# Altium schematic sheet 20_KEY_M_X2.SchDoc: C200
size 439 x 311 mm; Page Create Date: March  8, 1995; Page Number: 20; Page Size: Custom; Comment: radxa_1010; Page Count: 21; RevCode: V1.11; Doc: 20_KEY_M_X2; DsnPath: D:\WMS\C200\CC122\对外\C200 V1.11.DSN; SchematicName: c200; PageName: 20_KEY_M_X2; PageSize: Custom; TopSchematic: True
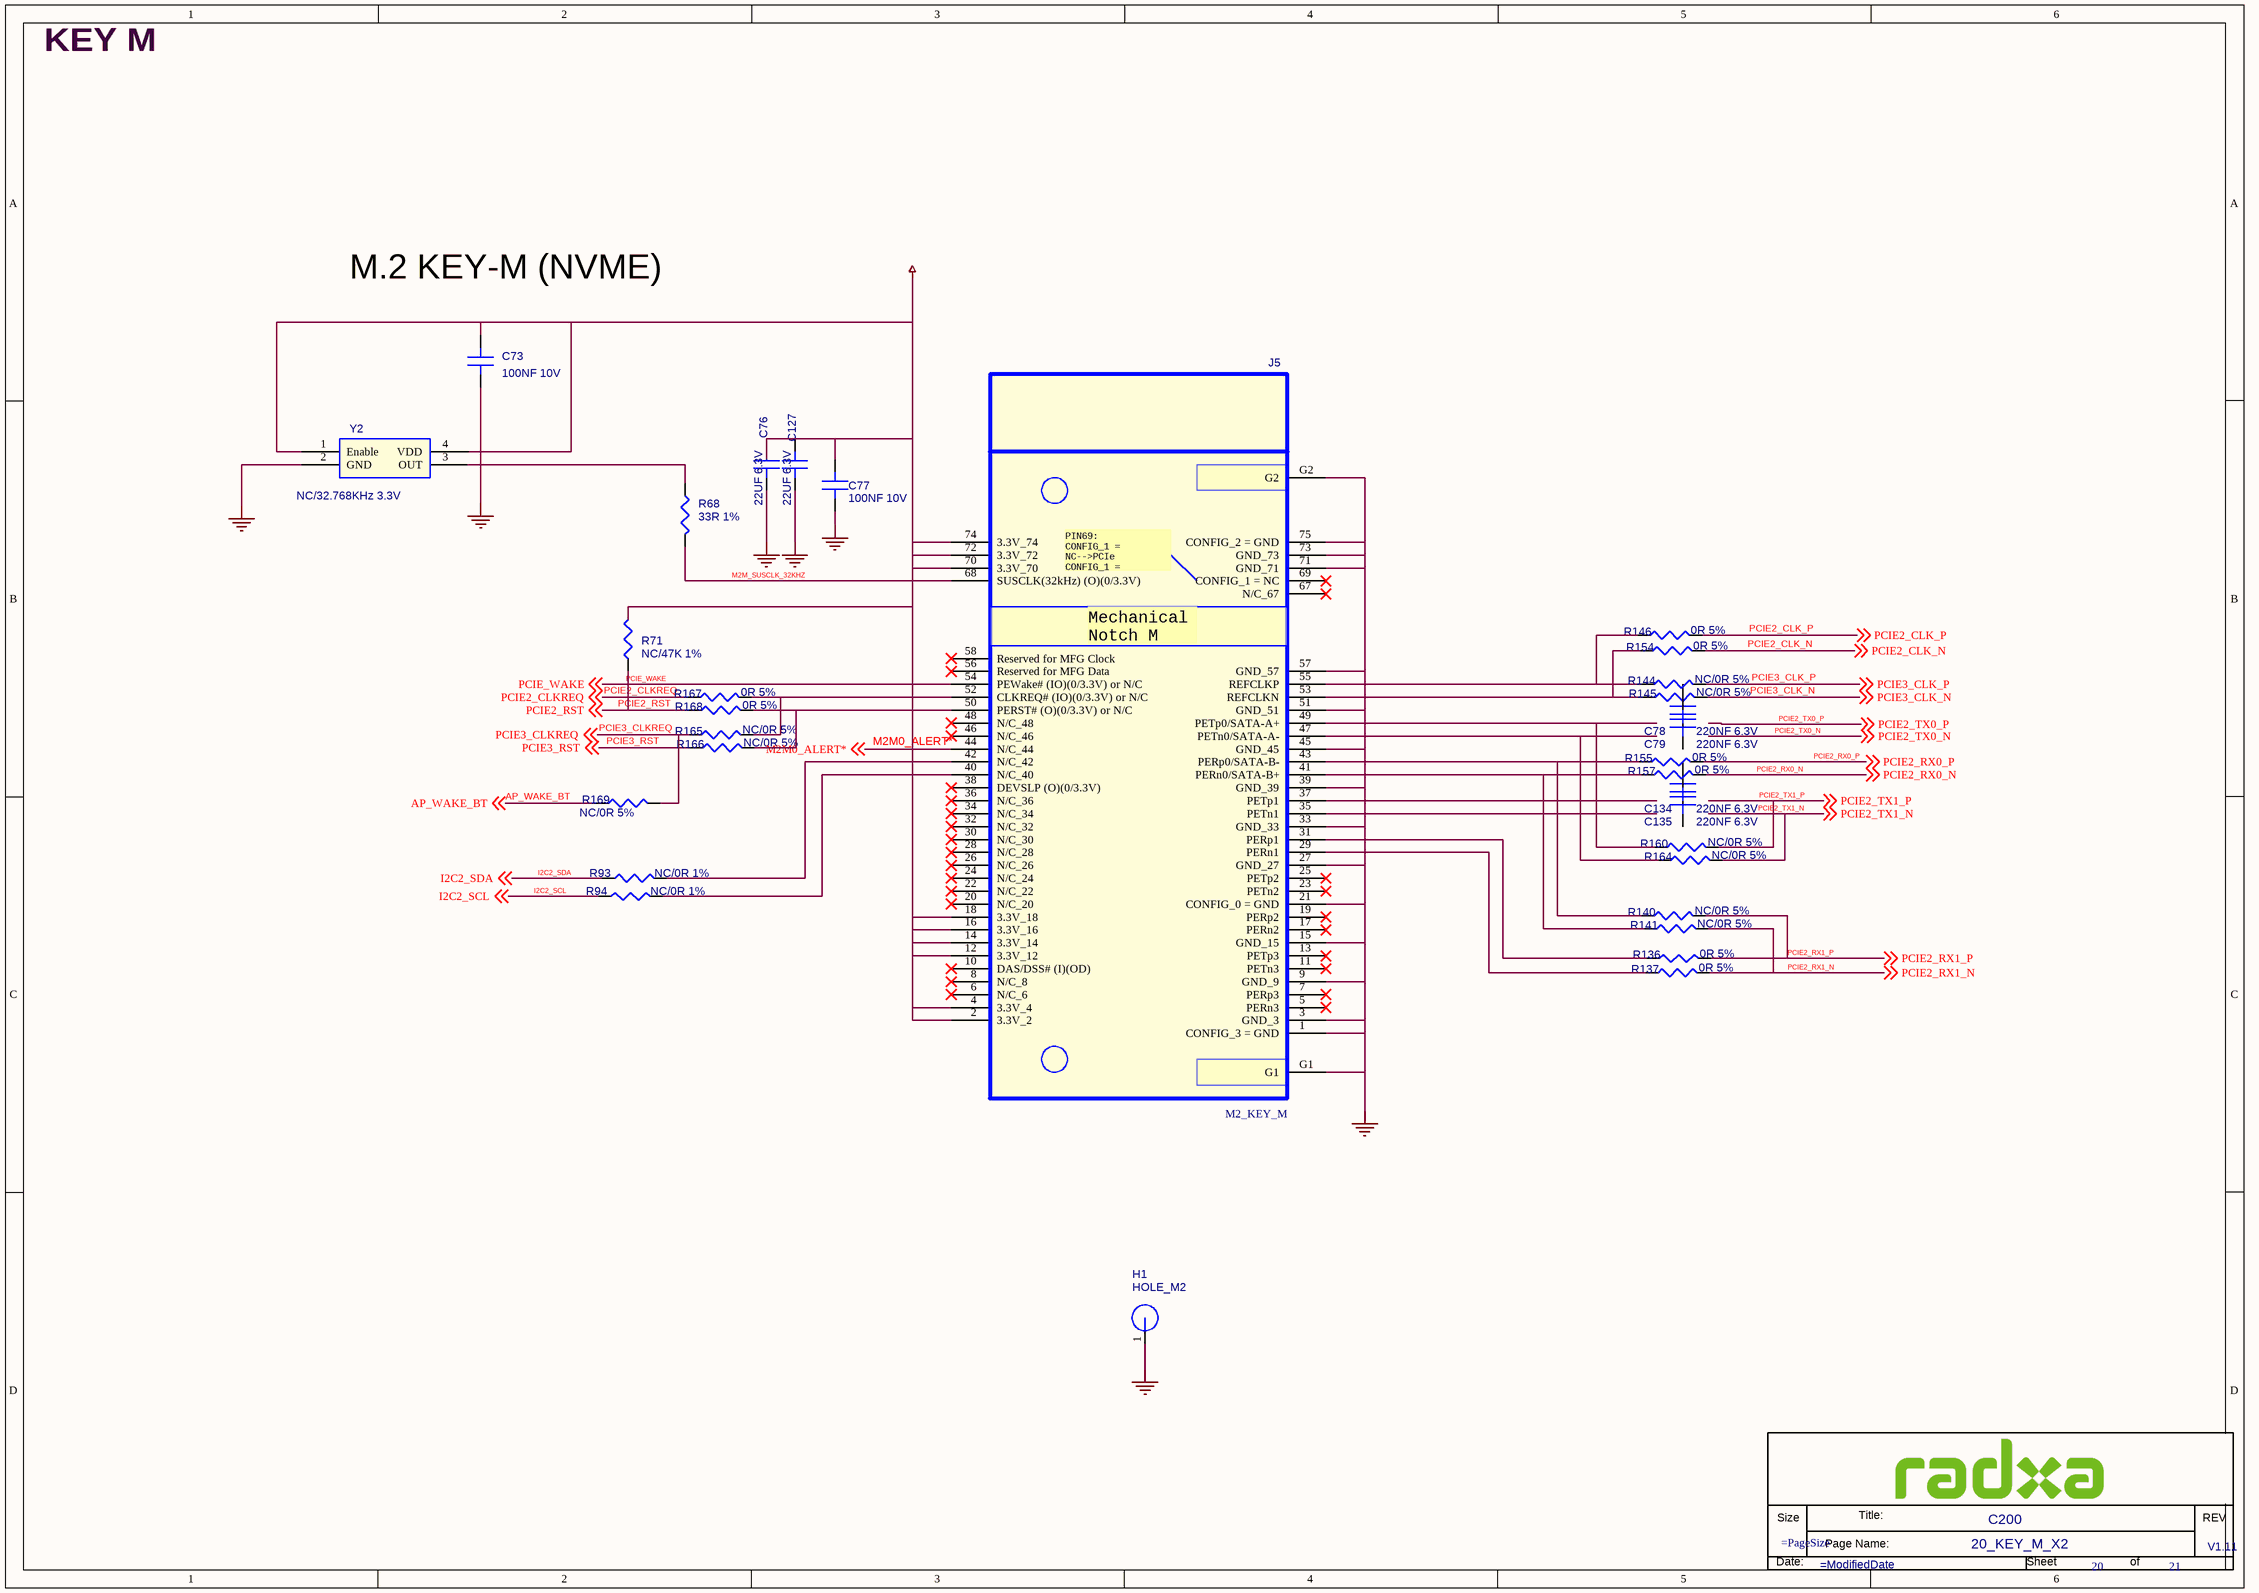
[diagram p0: 20_KEY_M_X2.SchDoc]

## Parts
*  Doc: 20_KEY_M_X2  RevCode: V1.11  Title: C200  Page Number: 20  Page Count: 21  (hidden comment: radxa_1010)  (graphical)
C73  100NF 10V  [C0402]
C76  22UF 6.3V  [C0603]
C77  100NF 10V  [C0402]
C78  220NF 6.3V  [C0201]
C79  220NF 6.3V  [C0201]
C127  22UF 6.3V  [C0603]
C134  220NF 6.3V  [C0201]
C135  220NF 6.3V  [C0201]
H1  HOLE_M2  [H3.8MM]
J5  M2_KEY_M  [M2-M_KEY_SM_75_0D5]
R68  33R 1%  [R0402]
R71  NC/47K 1%  [R0402]
R93  NC/0R 1%  [R0402]
R94  NC/0R 1%  [R0402]
R136  0R 5%  [R0402]
R137  0R 5%  [R0402]
R140  NC/0R 5%  [R0402]
R141  NC/0R 5%  [R0402]
R144  NC/0R 5%  [R0402]
R145  NC/0R 5%  [R0402]
R146  0R 5%  [R0402]
R154  0R 5%  [R0402]
R155  0R 5%  [R0402]
R157  0R 5%  [R0402]
R160  NC/0R 5%  [R0402]
R164  NC/0R 5%  [R0402]
R165  NC/0R 5%  [R0402]
R166  NC/0R 5%  [R0402]
R167  0R 5%  [R0402]
R168  0R 5%  [R0402]
R169  NC/0R 5%  [R0402]
Y2  NC/32.768KHz 3.3V  [Y-4-5_08-TXC-7W5]

## Nets
GND: C73.2(B) C76.2(B) C77.2(B) C127.2(B) H1.1 J5.1(CONFIG_3_=_GND) J5.3(GND_3) J5.9(GND_9) J5.15(GND_15) J5.21(CONFIG_0_=_GND) J5.27(GND_27) J5.33(GND_33) J5.39(GND_39) J5.45(GND_45) J5.51(GND_51) J5.57(GND_57) J5.71(GND_71) J5.73(GND_73) J5.75(CONFIG_2_=_GND) J5.G1 J5.G2 Y2.2(GND)
MKEY_3V3: C73.1(A) C76.1(A) C77.1(A) C127.1(A) J5.2(3.3V_2) J5.4(3.3V_4) J5.12(3.3V_12) J5.14(3.3V_14) J5.16(3.3V_16) J5.18(3.3V_18) J5.70(3.3V_70) J5.72(3.3V_72) J5.74(3.3V_74) R71.1 Y2.1(Enable) Y2.4(VDD)
AP_WAKE_BT: R169.1 ; off-sheet AP_WAKE_BT
I2C2_SCL: R94.1 ; off-sheet I2C2_SCL
I2C2_SDA: R93.1 ; off-sheet I2C2_SDA
M2M0_ALERT*: J5.44(N/C_44) ; off-sheet M2M0_ALERT*
M2M_SUSCLK_32KHZ: J5.68(SUSCLK(32kHz)_(O)(0/3.3V)) R68.2
PCIE2_CLK_N: R154.2 ; off-sheet PCIE2_CLK_N
PCIE2_CLK_P: R146.2 ; off-sheet PCIE2_CLK_P
PCIE2_CLKREQ: R167.1 ; off-sheet PCIE2_CLKREQ
PCIE2_RST: R71.2 R168.1 ; off-sheet PCIE2_RST
PCIE2_RX0_N: R157.2 ; off-sheet PCIE2_RX0_N
PCIE2_RX0_P: R155.2 ; off-sheet PCIE2_RX0_P
PCIE2_RX1_N: R137.2 R141.2 ; off-sheet PCIE2_RX1_N
PCIE2_RX1_P: R136.2 R140.2 ; off-sheet PCIE2_RX1_P
PCIE2_TX1_N: R164.2 ; off-sheet PCIE2_TX1_N
PCIE2_TX1_P: R160.2 ; off-sheet PCIE2_TX1_P
PCIE3_CLK_N: R145.2 ; off-sheet PCIE3_CLK_N
PCIE3_CLK_P: R144.2 ; off-sheet PCIE3_CLK_P
PCIE3_CLKREQ: R165.1 R169.2 ; off-sheet PCIE3_CLKREQ
PCIE3_RST: R166.1 ; off-sheet PCIE3_RST
PCIE_WAKE: J5.54(PEWake#_(IO)(0/3.3V)_or_N/C) ; off-sheet PCIE_WAKE
NetJ5_29: J5.29(PERn1) R137.1
NetJ5_31: J5.31(PERp1) R136.1
NetJ5_40: J5.40(N/C_40) R94.2
NetJ5_41: J5.41(PERn0/SATA-B+) R141.1 R157.1
NetJ5_42: J5.42(N/C_42) R93.2
NetJ5_43: J5.43(PERp0/SATA-B-) R140.1 R155.1
NetJ5_47: J5.47(PETn0/SATA-A-) R164.1
NetJ5_49: J5.49(PETp0/SATA-A+) R160.1
NetJ5_50: J5.50(PERST#_(O)(0/3.3V)_or_N/C) R166.2 R168.2
NetJ5_52: J5.52(CLKREQ#_(IO)(0/3.3V)_or_N/C) R165.2 R167.2
NetJ5_53: J5.53(REFCLKN) R145.1 R154.1
NetJ5_55: J5.55(REFCLKP) R144.1 R146.1
NetR68_1: R68.1 Y2.3(OUT)

Not connected (* = marked no-connect by the designer): C78 1(A) 2(B); C79 1(A) 2(B); C134 1(A) 2(B); C135 1(A) 2(B); J5 5(PERn3)* 6(N/C_6)* 7(PERp3)* 8(N/C_8)* 10(DAS/DSS#_(I)(OD))* 11(PETn3)* 13(PETp3)* 17(PERn2)* 19(PERp2)* 20(N/C_20)* 22(N/C_22)* 23(PETn2)* 24(N/C_24)* 25(PETp2)* 26(N/C_26)* 28(N/C_28)* 30(N/C_30)* 32(N/C_32)* 34(N/C_34)* 35(PETn1) 36(N/C_36)* 37(PETp1) 38(DEVSLP_(O)(0/3.3V))* 46(N/C_46)* 48(N/C_48)* 56(Reserved_for_MFG_Data)* 58(Reserved_for_MFG_Clock)* 67(N/C_67)* 69(CONFIG_1_=_NC)*

## Notes on the sheet
- KEY M
- M.2 KEY-M (NVME)
- (in symbol M2_KEY_M) PIN69: / CONFIG_1 = NC-->PCIe / CONFIG_1 = / GND-->SATA; Mechanical / Notch M
- (in symbol radxa_1010) Size; Title:; REV; Page Name:; Date:; Sheet; of

## Library data of the parts
C73 = C: SMD  0402  100NF  10V  X5R  ±10%  ROHS; PARTS: 1; Part Reference: C73; Part Number: A1C01.00163; OriginalSymbolOrigin: (0,30); PKG_TYPE: CAP2-100-250; LEVEL: STD; PINSWAP: (A,B); Value: 100NF 10V; Part Type: 陶瓷电容; PCB Footprint: C0402
C76 = C: SMD  0603  22UF  6.3V  X5R  ±20%  ROHS; PARTS: 1; Part Reference: C76; Part Number: A1C01.00004; OriginalSymbolOrigin: (0,30); PKG_TYPE: CAP2-100-250; LEVEL: STD; PINSWAP: (A,B); Value: 22UF 6.3V; Part Type: 陶瓷电容; PCB Footprint: C0603
C77 = C: SMD  0402  100NF  10V  X5R  ±10%  ROHS; PARTS: 1; Part Reference: C77; Part Number: A1C01.00163; OriginalSymbolOrigin: (0,30); PKG_TYPE: CAP2-100-250; LEVEL: STD; PINSWAP: (A,B); Value: 100NF 10V; Part Type: 陶瓷电容; PCB Footprint: C0402
C78 = C: SMD  0201  220NF  6.3V  X5R  ±20%  ROHS; PARTS: 1; Part Reference: C78; CDS_PART_NAME: C_0402-0.22UF,X5R,10%,6.3V,039-0011-000; CDS_PHYS_PART_NAME: C_0402-0.22UF,X5R,10%,6.3V,039-0011-000-0.22UF,039-0011-000; Part Number: A1C01.00128; OriginalSymbolOrigin: (0,30); PKG_TYPE: CAP2-100-250; LEVEL: STD; PINSWAP: (A,B); ASSEMBLY: M2_NVME; CDS_LIB: discrete; DEVICE_TYPENAME: C_0402-022UFX5R1063V039-0011-000-022UF039-0011-000; DRAWING: #NAME?; NV_PN: 039-0011-000; PACK_TYPE: 402; PATH: I24; PHYS_PAGE: 21; ROT: 0; SIGNAL_MODEL: nv_cap; TOL: 10%; VER: 2; XY: (-3150,4300); Value: 220NF 6.3V; CDS_SEC: 1; CHIPS_PART_NAME: C; MAT: X5R; MAX_VOLTAGE: 6.3V; SEC: 1; Part Type: 陶瓷电容; PCB Footprint: C0201
C79 = C: SMD  0201  220NF  6.3V  X5R  ±20%  ROHS; PARTS: 1; Part Reference: C79; CDS_PART_NAME: C_0402-0.22UF,X5R,10%,6.3V,039-0011-000; CDS_PHYS_PART_NAME: C_0402-0.22UF,X5R,10%,6.3V,039-0011-000-0.22UF,039-0011-000; Part Number: A1C01.00128; OriginalSymbolOrigin: (0,30); PKG_TYPE: CAP2-100-250; LEVEL: STD; PINSWAP: (A,B); ASSEMBLY: M2_NVME; CDS_LIB: discrete; DEVICE_TYPENAME: C_0402-022UFX5R1063V039-0011-000-022UF039-0011-000; DRAWING: #NAME?; NV_PN: 039-0011-000; PACK_TYPE: 402; PATH: I8; PHYS_PAGE: 21; ROT: 0; SIGNAL_MODEL: nv_cap; TOL: 10%; VER: 2; XY: (-2700,4250); Value: 220NF 6.3V; CDS_SEC: 1; CHIPS_PART_NAME: C; MAT: X5R; MAX_VOLTAGE: 6.3V; SEC: 1; Part Type: 陶瓷电容; PCB Footprint: C0201
C127 = C: SMD  0603  22UF  6.3V  X5R  ±20%  ROHS; PARTS: 1; Part Reference: C127; Part Number: A1C01.00004; OriginalSymbolOrigin: (0,30); PKG_TYPE: CAP2-100-250; LEVEL: STD; PINSWAP: (A,B); Value: 22UF 6.3V; Part Type: 陶瓷电容; PCB Footprint: C0603
C134 = C: SMD  0201  220NF  6.3V  X5R  ±20%  ROHS; PARTS: 1; Part Reference: C134; CDS_PART_NAME: C_0402-0.22UF,X5R,10%,6.3V,039-0011-000; CDS_PHYS_PART_NAME: C_0402-0.22UF,X5R,10%,6.3V,039-0011-000-0.22UF,039-0011-000; Part Number: A1C01.00128; OriginalSymbolOrigin: (0,30); PKG_TYPE: CAP2-100-250; LEVEL: STD; PINSWAP: (A,B); ASSEMBLY: M2_NVME; CDS_LIB: discrete; DEVICE_TYPENAME: C_0402-022UFX5R1063V039-0011-000-022UF039-0011-000; DRAWING: #NAME?; NV_PN: 039-0011-000; PACK_TYPE: 402; PATH: I32; PHYS_PAGE: 21; ROT: 0; SIGNAL_MODEL: nv_cap; TOL: 10%; VER: 2; XY: (-3150,4000); Value: 220NF 6.3V; CDS_SEC: 1; CHIPS_PART_NAME: C; MAT: X5R; MAX_VOLTAGE: 6.3V; SEC: 1; Part Type: 陶瓷电容; PCB Footprint: C0201
C135 = C: SMD  0201  220NF  6.3V  X5R  ±20%  ROHS; PARTS: 1; Part Reference: C135; CDS_PART_NAME: C_0402-0.22UF,X5R,10%,6.3V,039-0011-000; CDS_PHYS_PART_NAME: C_0402-0.22UF,X5R,10%,6.3V,039-0011-000-0.22UF,039-0011-000; Part Number: A1C01.00128; OriginalSymbolOrigin: (0,30); PKG_TYPE: CAP2-100-250; LEVEL: STD; PINSWAP: (A,B); ASSEMBLY: M2_NVME; CDS_LIB: discrete; DEVICE_TYPENAME: C_0402-022UFX5R1063V039-0011-000-022UF039-0011-000; DRAWING: #NAME?; NV_PN: 039-0011-000; PACK_TYPE: 402; PATH: I21; PHYS_PAGE: 21; ROT: 0; SIGNAL_MODEL: nv_cap; TOL: 10%; VER: 2; XY: (-2700,3950); Value: 220NF 6.3V; CDS_SEC: 1; CHIPS_PART_NAME: C; MAT: X5R; MAX_VOLTAGE: 6.3V; SEC: 1; Part Type: 陶瓷电容; PCB Footprint: C0201
H1 = HOLE: Part Reference: H1; PCB Footprint: HOLE_2D7_6D0_A; RK PN: HOLE_3R50; Priority: A; Value: HOLE_M2; Part Type: HOLE
J5 = M2_KEY_M: SMD  母座  75PIN  180度  M.2  M KEY  H4.2  0.5mm脚距  APC10359-P001A  黑色  LOTES  ROHS; Part Reference: J5; Part Number: A1J01.00017; Parameter: 连接器-比派-封装 M2_KEY_M; Value: M2_KEY_M; Part Type: 连接座; PCB Footprint: M2-M_KEY_SM_75_0D5
R68 = R: SMD  0201  33R  1/20W  ±1%  ROHS; Part Reference: R68; Part Number: A1R01.00137; PCB Footprint: R0201; Value: 33R 1%; Part Type: 贴片电阻
R71 = R: SMD  0402  47K  1/16W  ±1%  ROHS; Part Reference: R71; Part Number: A1R01.00248; CDS_PART_NAME: R_0402-47K,5 %,62.5MW,195-0599-000; CDS_PHYS_PART_NAME: R_0402-47K,5 %,62.5MW,195-0599-000-195-0599-000,47K; ASSEMBLY: M2_NVME; CDS_LIB: discrete; CDS_SEC: 1; DEVICE_TYPENAME: R_0402-47K5625MW195-0599-000-195-0599-00047K; DRAWING: #NAME?; MAX_WATTAGE: 62.5mW; NV_PN: 195-0599-000; PACK_TYPE: 402; PATH: I39; PHYS_PAGE: 21; ROT: 2; SIGNAL_MODEL: nv_res; TOL: 5%; XY: (-8000,4600); PCB Footprint: R0402; Value: NC/47K 1%; Part Type: 贴片电阻; CHIPS_PART_NAME: R; SKU: NO STUFF; VER: 2; SEC: 1
R93 = R: SMD  0402  0R  1/16W  ±1%  ROHS; Part Reference: R93; Part Number: A1R01.00219; PCB Footprint: R0402; Value: NC/0R 1%; Part Type: 贴片电阻
R94 = R: SMD  0402  0R  1/16W  ±1%  ROHS; Part Reference: R94; Part Number: A1R01.00219; PCB Footprint: R0402; Value: NC/0R 1%; Part Type: 贴片电阻
R136 = R: SMD  0201  0R  1/20W  ±5%  ROHS; Part Reference: R136; Part Number: A1R01.00027; PCB Footprint: R0201; Temp Coeff: －55℃ ~ ＋125℃; Value: 0R 5%; Part Type: 贴片电阻
R137 = R: SMD  0201  0R  1/20W  ±5%  ROHS; Part Reference: R137; Part Number: A1R01.00027; PCB Footprint: R0201; Temp Coeff: －55℃ ~ ＋125℃; Value: 0R 5%; Part Type: 贴片电阻
R140 = R: SMD  0201  0R  1/20W  ±5%  ROHS; Part Reference: R140; Part Number: A1R01.00027; PCB Footprint: R0201; Temp Coeff: －55℃ ~ ＋125℃; Value: NC/0R 5%; Part Type: 贴片电阻
R141 = R: SMD  0201  0R  1/20W  ±5%  ROHS; Part Reference: R141; Part Number: A1R01.00027; PCB Footprint: R0201; Temp Coeff: －55℃ ~ ＋125℃; Value: NC/0R 5%; Part Type: 贴片电阻
R144 = R: SMD  0201  0R  1/20W  ±5%  ROHS; Part Reference: R144; Part Number: A1R01.00027; PCB Footprint: R0201; Temp Coeff: －55℃ ~ ＋125℃; Value: NC/0R 5%; Part Type: 贴片电阻
R145 = R: SMD  0201  0R  1/20W  ±5%  ROHS; Part Reference: R145; Part Number: A1R01.00027; PCB Footprint: R0201; Temp Coeff: －55℃ ~ ＋125℃; Value: NC/0R 5%; Part Type: 贴片电阻
R146 = R: SMD  0201  0R  1/20W  ±5%  ROHS; Part Reference: R146; Part Number: A1R01.00027; PCB Footprint: R0201; Temp Coeff: －55℃ ~ ＋125℃; Value: 0R 5%; Part Type: 贴片电阻
R154 = R: SMD  0201  0R  1/20W  ±5%  ROHS; Part Reference: R154; Part Number: A1R01.00027; PCB Footprint: R0201; Temp Coeff: －55℃ ~ ＋125℃; Value: 0R 5%; Part Type: 贴片电阻
R155 = R: SMD  0201  0R  1/20W  ±5%  ROHS; Part Reference: R155; Part Number: A1R01.00027; PCB Footprint: R0201; Temp Coeff: －55℃ ~ ＋125℃; Value: 0R 5%; Part Type: 贴片电阻
R157 = R: SMD  0201  0R  1/20W  ±5%  ROHS; Part Reference: R157; Part Number: A1R01.00027; PCB Footprint: R0201; Temp Coeff: －55℃ ~ ＋125℃; Value: 0R 5%; Part Type: 贴片电阻
R160 = R: SMD  0201  0R  1/20W  ±5%  ROHS; Part Reference: R160; Part Number: A1R01.00027; PCB Footprint: R0201; Temp Coeff: －55℃ ~ ＋125℃; Value: NC/0R 5%; Part Type: 贴片电阻
R164 = R: SMD  0201  0R  1/20W  ±5%  ROHS; Part Reference: R164; Part Number: A1R01.00027; PCB Footprint: R0201; Temp Coeff: －55℃ ~ ＋125℃; Value: NC/0R 5%; Part Type: 贴片电阻
R165 = R: SMD  0201  0R  1/20W  ±5%  ROHS; Part Reference: R165; Part Number: A1R01.00027; PCB Footprint: R0201; Temp Coeff: －55℃ ~ ＋125℃; Value: NC/0R 5%; Part Type: 贴片电阻
R166 = R: SMD  0201  0R  1/20W  ±5%  ROHS; Part Reference: R166; Part Number: A1R01.00027; PCB Footprint: R0201; Temp Coeff: －55℃ ~ ＋125℃; Value: NC/0R 5%; Part Type: 贴片电阻
R167 = R: SMD  0201  0R  1/20W  ±5%  ROHS; Part Reference: R167; Part Number: A1R01.00027; PCB Footprint: R0201; Temp Coeff: －55℃ ~ ＋125℃; Value: 0R 5%; Part Type: 贴片电阻
R168 = R: SMD  0201  0R  1/20W  ±5%  ROHS; Part Reference: R168; Part Number: A1R01.00027; PCB Footprint: R0201; Temp Coeff: －55℃ ~ ＋125℃; Value: 0R 5%; Part Type: 贴片电阻
R169 = R: SMD  0201  0R  1/20W  ±5%  ROHS; Part Reference: R169; Part Number: A1R01.00027; PCB Footprint: R0201; Temp Coeff: －55℃ ~ ＋125℃; Value: NC/0R 5%; Part Type: 贴片电阻
Y2 = OSC_4P_V: SMD  编带  有源  3225  32.768KHz  3.3V  ±10ppm  ROHS; Part Reference: Y2; Part Number: A1Y01.00030; PCB Footprint: OSC_SM4_3D2X2D5; Value: NC/32.768KHz 3.3V; Part Type: 晶振
* = radxa_1010: Page Create Date: March  8, 1995; Page Size: =PageSize; Page Modify Date: =ModifiedDate